# Altium project BAS_DevKITV3.PrjPcb (part 2 of 2)

## Sheet 201_USB3Hub.SchDoc: USB Control Hub
size A2; Organization: Greenfield Tech Solutions; Address1: Molendreef 33; Address2: Ossendrecht; Address3: 4641CS; Address4: The Netherlands; DocumentNumber: P234; Revision: 3.0; SheetNumber: 3; SheetTotal: 8
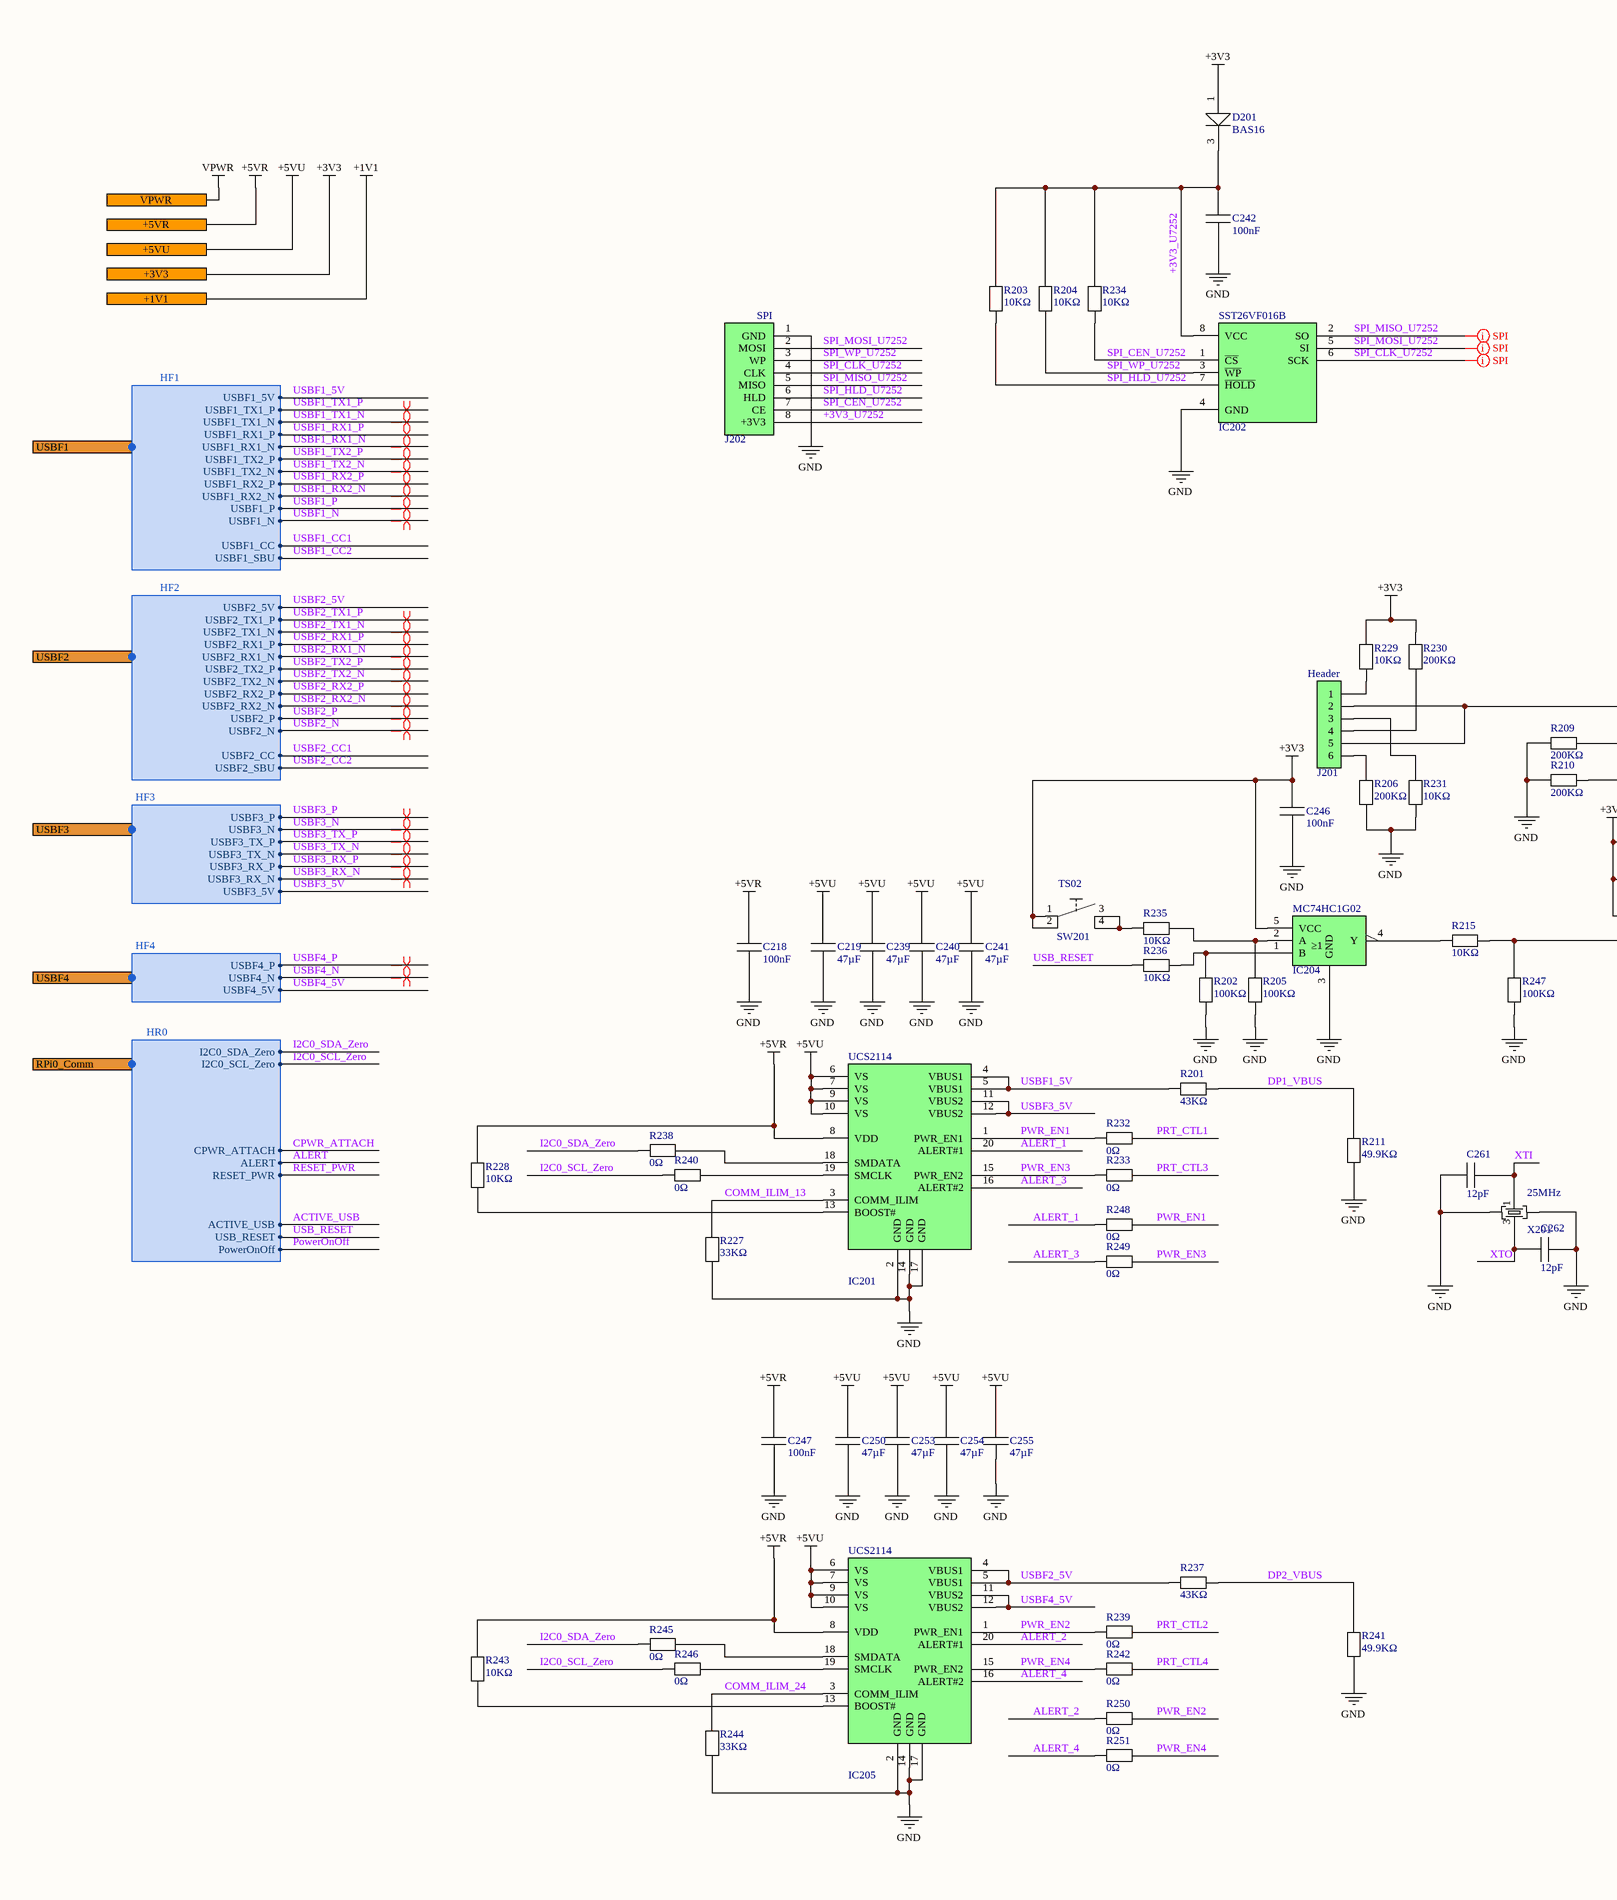
[diagram p8: 201_USB3Hub.SchDoc, left]
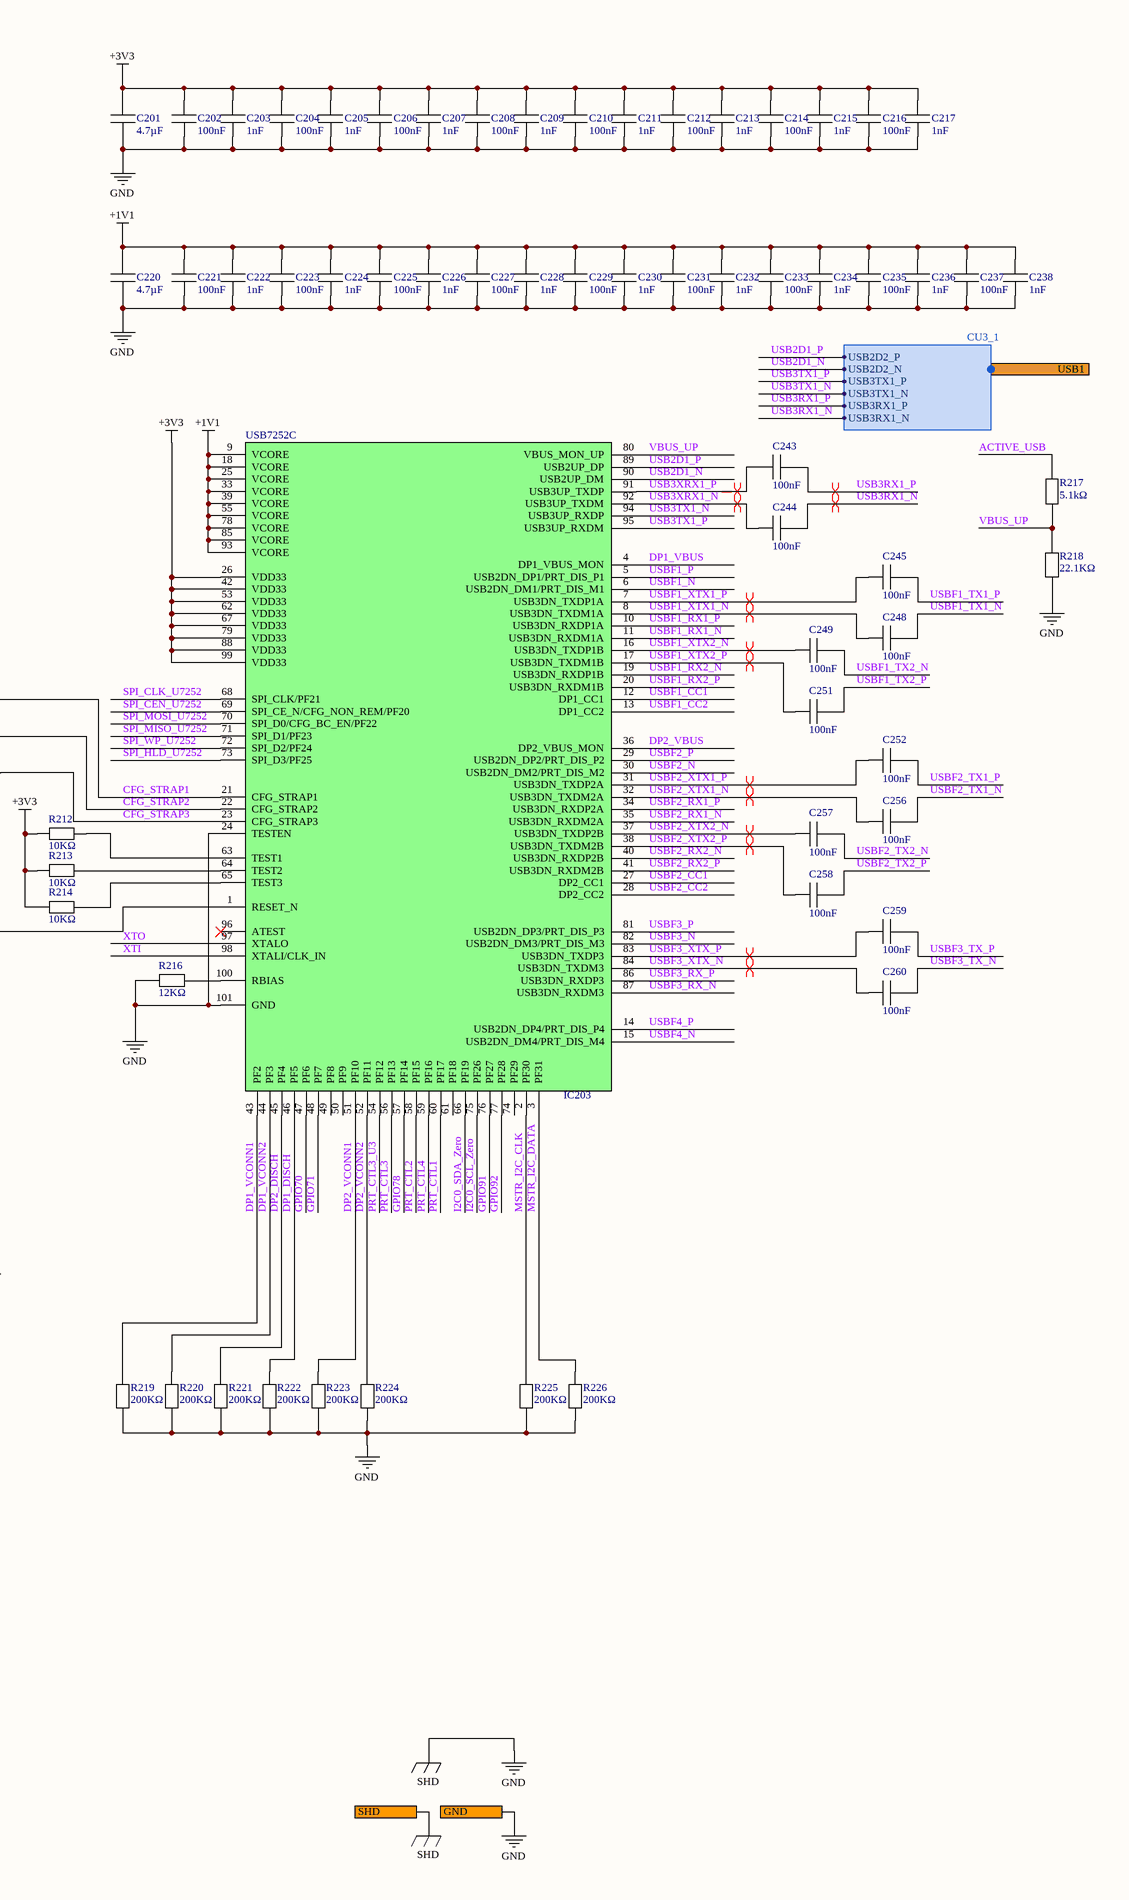
[diagram p9: 201_USB3Hub.SchDoc, right]

### Parts
C201  4.7µF  [C0603]
C202  100nF  [C0402]
C203  1nF  [C0402]
C204  100nF  [C0402]
C205  1nF  [C0402]
C206  100nF  [C0402]
C207  1nF  [C0402]
C208  100nF  [C0402]
C209  1nF  [C0402]
C210  100nF  [C0402]
C211  1nF  [C0402]
C212  100nF  [C0402]
C213  1nF  [C0402]
C214  100nF  [C0402]
C215  1nF  [C0402]
C216  100nF  [C0402]
C217  1nF  [C0402]
C218  100nF  [C0402]
C219  47µF  [C1210]
C220  4.7µF  [C0603]
C221  100nF  [C0402]
C222  1nF  [C0402]
C223  100nF  [C0402]
C224  1nF  [C0402]
C225  100nF  [C0402]
C226  1nF  [C0402]
C227  100nF  [C0402]
C228  1nF  [C0402]
C229  100nF  [C0402]
C230  1nF  [C0402]
C231  100nF  [C0402]
C232  1nF  [C0402]
C233  100nF  [C0402]
C234  1nF  [C0402]
C235  100nF  [C0402]
C236  1nF  [C0402]
C237  100nF  [C0402]
C238  1nF  [C0402]
C239  47µF  [C1210]
C240  47µF  [C1210]
C241  47µF  [C1210]
C242  100nF  [C0402]
C243  100nF  [C0402]
C244  100nF  [C0402]
C245  100nF  [C0402]
C246  100nF  [C0402]
C247  100nF  [C0402]
C248  100nF  [C0402]
C249  100nF  [C0402]
C250  47µF  [C1210]
C251  100nF  [C0402]
C252  100nF  [C0402]
C253  47µF  [C1210]
C254  47µF  [C1210]
C255  47µF  [C1210]
C256  100nF  [C0402]
C257  100nF  [C0402]
C258  100nF  [C0402]
C259  100nF  [C0402]
C260  100nF  [C0402]
C261  12pF  [C0402]
C262  12pF  [C0402]
D201  BAS16  [SOT-23]
IC201  UCS2114  [VQFN-20_3X3]
IC202  SST26VF016B  [SO-8]
IC203  USB7252C  [VQFN-100G_12X12]
IC204  MC74HC1G02  [TSOP-5]
IC205  UCS2114  [VQFN-20_3X3]
J201  Header  [1X6P_2.54MM_SMT]
J202  SPI  [SPI_PROG_TYPE1]
R201  43KΩ  [R0402]
R202  100KΩ  [R0402]
R203  10KΩ  [R0402]
R204  10KΩ  [R0402]
R205  100KΩ  [R0402]
R206  200KΩ  [R0402]
R209  200KΩ  [R0402]
R210  200KΩ  [R0402]
R211  49.9KΩ  [R0402]
R212  10KΩ  [R0402]
R213  10KΩ  [R0402]
R214  10KΩ  [R0402]
R215  10KΩ  [R0402]
R216  12KΩ  [R0402]
R217  5.1kΩ  [R0402]
R218  22.1KΩ  [R0603]
R219  200KΩ  [R0402]
R220  200KΩ  [R0402]
R221  200KΩ  [R0402]
R222  200KΩ  [R0402]
R223  200KΩ  [R0402]
R224  200KΩ  [R0402]
R225  200KΩ  [R0402]
R226  200KΩ  [R0402]
R227  33KΩ  [R0402]
R228  10KΩ  [R0402]
R229  10KΩ  [R0402]
R230  200KΩ  [R0402]
R231  10KΩ  [R0402]
R232  0Ω  [R0402]
R233  0Ω  [R0402]
R234  10KΩ  [R0402]
R235  10KΩ  [R0402]
R236  10KΩ  [R0402]
R237  43KΩ  [R0402]
R238  0Ω  [R0402]
R239  0Ω  [R0402]
R240  0Ω  [R0402]
R241  49.9KΩ  [R0402]
R242  0Ω  [R0402]
R243  10KΩ  [R0402]
R244  33KΩ  [R0402]
R245  0Ω  [R0402]
R246  0Ω  [R0402]
R247  100KΩ  [R0402]
R248  0Ω  [R0402]
R249  0Ω  [R0402]
R250  0Ω  [R0402]
R251  0Ω  [R0402]
SW201  TS02  [TS02]
X201  25MHz  [403W]

### Ports
+1V1, +3V3, +5VR, +5VU, GND, RPi0_Comm (harness HR0), SHD, USB1 (harness CU3_1), USBF1 (harness HF1), USBF2 (harness HF2), USBF3 (harness HF3), USBF4 (harness HF4), VPWR

### Harnesses
HF1: USBF1_5V, USBF1_TX1_P, USBF1_TX1_N, USBF1_RX1_P, USBF1_RX1_N, USBF1_CC, USBF1_SBU, USBF1_RX2_P, USBF1_RX2_N, USBF1_TX2_P, USBF1_TX2_N, USBF1_N, USBF1_P
CU3_1: USB2D2_N, USB2D2_P, USB3TX1_N, USB3TX1_P, USB3RX1_N, USB3RX1_P
HF2: USBF2_5V, USBF2_TX1_P, USBF2_TX1_N, USBF2_RX1_P, USBF2_RX1_N, USBF2_CC, USBF2_SBU, USBF2_RX2_P, USBF2_RX2_N, USBF2_TX2_P, USBF2_TX2_N, USBF2_N, USBF2_P
HF4: USBF4_N, USBF4_P, USBF4_5V
HR0: I2C0_SCL_Zero, I2C0_SDA_Zero, CPWR_ATTACH, PowerOnOff, USB_RESET, ACTIVE_USB, ALERT, RESET_PWR
HF3: USBF3_N, USBF3_P, USBF3_TX_N, USBF3_TX_P, USBF3_RX_N, USBF3_RX_P, USBF3_5V

### Nets
+1V1: C220.1 C221.1 C222.1 C223.1 C224.1 C225.1 C226.1 C227.1 C228.1 C229.1 C230.1 C231.1 C232.1 C233.1 C234.1 C235.1 C236.1 C237.1 C238.1 IC203.9(VCORE) IC203.18(VCORE) IC203.25(VCORE) IC203.33(VCORE) IC203.39(VCORE) IC203.55(VCORE) IC203.78(VCORE) IC203.85(VCORE) IC203.93(VCORE) ; port +1V1
+3V3: C201.1 C202.1 C203.1 C204.1 C205.1 C206.1 C207.1 C208.1 C209.1 C210.1 C211.1 C212.1 C213.1 C214.1 C215.1 C216.1 C217.1 C246.1 D201.1(A) IC203.26(VDD33) IC203.42(VDD33) IC203.53(VDD33) IC203.62(VDD33) IC203.67(VDD33) IC203.79(VDD33) IC203.88(VDD33) IC203.99(VDD33) IC204.5(VCC) R212.1 R213.1 R214.1 R229.2 R230.1 SW201.1 SW201.2 ; port +3V3
+5VR: C218.1 C247.1 IC201.8(VDD) IC205.8(VDD) R228.2 R243.2 ; port +5VR
+5VU: C219.1 C239.1 C240.1 C241.1 C250.1 C253.1 C254.1 C255.1 IC201.6(VS) IC201.7(VS) IC201.9(VS) IC201.10(VS) IC205.6(VS) IC205.7(VS) IC205.9(VS) IC205.10(VS) ; port +5VU
GND: C201.2 C202.2 C203.2 C204.2 C205.2 C206.2 C207.2 C208.2 C209.2 C210.2 C211.2 C212.2 C213.2 C214.2 C215.2 C216.2 C217.2 C218.2 C219.2 C220.2 C221.2 C222.2 C223.2 C224.2 C225.2 C226.2 C227.2 C228.2 C229.2 C230.2 C231.2 C232.2 C233.2 C234.2 C235.2 C236.2 C237.2 C238.2 C239.2 C240.2 C241.2 C242.2 C246.2 C247.2 C250.2 C253.2 C254.2 C255.2 C261.1 C262.2 IC201.2(GND) IC201.14(GND) IC201.17(GND) IC202.4(GND) IC203.24(TESTEN) IC203.101(GND) IC204.3(GND) IC205.2(GND) IC205.14(GND) IC205.17(GND) J202.1(GND) R202.1 R205.1 R206.2 R209.1 R210.1 R211.1 R216.1 R218.1 R219.1 R220.1 R221.1 R222.1 R223.1 R224.1 R225.1 R226.1 R227.1 R231.1 R241.1 R244.1 R247.1 X201.2 X201.4 ; port GND, port SHD  [also labelled SHD]
+3V3_U7252: C242.1 D201.3(K) IC202.8(VCC) J202.8(+3V3) R203.2 R204.2 R234.2
ACTIVE_USB: R217.2 ; port RPi0_Comm.ACTIVE_USB
ALERT_1: IC201.20(ALERT#1) R248.1
ALERT_2: IC205.20(ALERT#1) R250.1
ALERT_3: IC201.16(ALERT#2) R249.1
ALERT_4: IC205.16(ALERT#2) R251.1
CFG_STRAP1: IC203.21(CFG_STRAP1) J201.2 J201.5
CFG_STRAP2: IC203.22(CFG_STRAP2) R209.2
CFG_STRAP3: IC203.23(CFG_STRAP3) R210.2
COMM_ILIM_13: IC201.3(COMM_ILIM) R227.2
COMM_ILIM_24: IC205.3(COMM_ILIM) R244.2
DP1_DISCH: IC203.46(PF5) R222.2
DP1_VBUS: IC203.4(DP1_VBUS_MON) R201.2 R211.2
DP1_VCONN1: IC203.43(PF2) R219.2
DP1_VCONN2: IC203.44(PF3) R220.2
DP2_DISCH: IC203.45(PF4) R221.2
DP2_VBUS: IC203.36(DP2_VBUS_MON) R237.2 R241.2
DP2_VCONN1: IC203.51(PF10) R223.2
DP2_VCONN2: IC203.52(PF11) R224.2
GPIO70: IC203.47(PF6)
GPIO71: IC203.48(PF7)
GPIO78: IC203.57(PF14)
GPIO91: IC203.76(PF27)
GPIO92: IC203.77(PF28)
I2C0_SCL_Zero: IC203.75(PF26) R240.1 R246.1 ; port RPi0_Comm.I2C0_SCL_Zero
I2C0_SDA_Zero: IC203.66(PF19) R238.1 R245.1 ; port RPi0_Comm.I2C0_SDA_Zero
MSTR_I2C_CLK: IC203.2(PF30) R225.2
MSTR_I2C_DATA: IC203.3(PF31) R226.2
PowerOnOff: port RPi0_Comm.PowerOnOff
PRT_CTL1: IC203.60(PF17) R232.2
PRT_CTL2: IC203.58(PF15) R239.2
PRT_CTL3: IC203.56(PF13) R233.2
PRT_CTL3_U3: IC203.54(PF12)
PRT_CTL4: IC203.59(PF16) R242.2
PWR_EN1: IC201.1(PWR_EN1) R232.1 R248.2
PWR_EN2: IC205.1(PWR_EN1) R239.1 R250.2
PWR_EN3: IC201.15(PWR_EN2) R233.1 R249.2
PWR_EN4: IC205.15(PWR_EN2) R242.1 R251.2
SPI_CEN_U7252: IC202.1(~{CS}) IC203.69(SPI_CE_N/CFG_NON_REM/PF20) J202.7(CE) R234.1
SPI_CLK_U7252: IC202.6(SCK) IC203.68(SPI_CLK/PF21) J202.4(CLK)
SPI_HLD_U7252: IC202.7(~{HOLD}) IC203.73(SPI_D3/PF25) J202.6(HLD) R203.1
SPI_MISO_U7252: IC202.2(SO) IC203.71(SPI_D1/PF23) J202.5(MISO)
SPI_MOSI_U7252: IC202.5(SI) IC203.70(SPI_D0/CFG_BC_EN/PF22) J202.2(MOSI)
SPI_WP_U7252: IC202.3(~{WP}) IC203.72(SPI_D2/PF24) J202.3(WP) R204.1
USB2D1_N: IC203.90(USB2UP_DM) ; port USB1.USB2D2_N
USB2D1_P: IC203.89(USB2UP_DP) ; port USB1.USB2D2_P
USB3RX1_N: C244.2 ; port USB1.USB3RX1_N
USB3RX1_P: C243.2 ; port USB1.USB3RX1_P
USB3TX1_N: IC203.94(USB3UP_RXDP) ; port USB1.USB3TX1_N
USB3TX1_P: IC203.95(USB3UP_RXDM) ; port USB1.USB3TX1_P
USB3XRX1_N: C244.1 IC203.92(USB3UP_TXDM)
USB3XRX1_P: C243.1 IC203.91(USB3UP_TXDP)
USB_RESET: R236.2 ; port RPi0_Comm.USB_RESET
USBF1_5V: IC201.4(VBUS1) IC201.5(VBUS1) R201.1 ; port USBF1.USBF1_5V
USBF1_CC1: IC203.12(DP1_CC1) ; port USBF1.USBF1_CC
USBF1_CC2: IC203.13(DP1_CC2) ; port USBF1.USBF1_SBU
USBF1_N: IC203.6(USB2DN_DM1/PRT_DIS_M1) ; port USBF1.USBF1_N
USBF1_P: IC203.5(USB2DN_DP1/PRT_DIS_P1) ; port USBF1.USBF1_P
USBF1_RX1_N: IC203.11(USB3DN_RXDM1A) ; port USBF1.USBF1_RX1_N
USBF1_RX1_P: IC203.10(USB3DN_RXDP1A) ; port USBF1.USBF1_RX1_P
USBF1_RX2_N: IC203.19(USB3DN_RXDP1B) ; port USBF1.USBF1_RX2_N
USBF1_RX2_P: IC203.20(USB3DN_RXDM1B) ; port USBF1.USBF1_RX2_P
USBF1_TX1_N: C248.2 ; port USBF1.USBF1_TX1_N
USBF1_TX1_P: C245.2 ; port USBF1.USBF1_TX1_P
USBF1_TX2_N: C249.2 ; port USBF1.USBF1_TX2_N
USBF1_TX2_P: C251.2 ; port USBF1.USBF1_TX2_P
USBF1_XTX1_N: C248.1 IC203.8(USB3DN_TXDM1A)
USBF1_XTX1_P: C245.1 IC203.7(USB3DN_TXDP1A)
USBF1_XTX2_N: C249.1 IC203.16(USB3DN_TXDP1B)
USBF1_XTX2_P: C251.1 IC203.17(USB3DN_TXDM1B)
USBF2_5V: IC205.4(VBUS1) IC205.5(VBUS1) R237.1 ; port USBF2.USBF2_5V
USBF2_CC1: IC203.27(DP2_CC1) ; port USBF2.USBF2_CC
USBF2_CC2: IC203.28(DP2_CC2) ; port USBF2.USBF2_SBU
USBF2_N: IC203.30(USB2DN_DM2/PRT_DIS_M2) ; port USBF2.USBF2_N
USBF2_P: IC203.29(USB2DN_DP2/PRT_DIS_P2) ; port USBF2.USBF2_P
USBF2_RX1_N: IC203.35(USB3DN_RXDM2A) ; port USBF2.USBF2_RX1_N
USBF2_RX1_P: IC203.34(USB3DN_RXDP2A) ; port USBF2.USBF2_RX1_P
USBF2_RX2_N: IC203.40(USB3DN_RXDP2B) ; port USBF2.USBF2_RX2_N
USBF2_RX2_P: IC203.41(USB3DN_RXDM2B) ; port USBF2.USBF2_RX2_P
USBF2_TX1_N: C256.2 ; port USBF2.USBF2_TX1_N
USBF2_TX1_P: C252.2 ; port USBF2.USBF2_TX1_P
USBF2_TX2_N: C257.2 ; port USBF2.USBF2_TX2_N
USBF2_TX2_P: C258.2 ; port USBF2.USBF2_TX2_P
USBF2_XTX1_N: C256.1 IC203.32(USB3DN_TXDM2A)
USBF2_XTX1_P: C252.1 IC203.31(USB3DN_TXDP2A)
USBF2_XTX2_N: C257.1 IC203.37(USB3DN_TXDP2B)
USBF2_XTX2_P: C258.1 IC203.38(USB3DN_TXDM2B)
USBF3_5V: IC201.11(VBUS2) IC201.12(VBUS2) ; port USBF3.USBF3_5V
USBF3_N: IC203.82(USB2DN_DM3/PRT_DIS_M3) ; port USBF3.USBF3_N
USBF3_P: IC203.81(USB2DN_DP3/PRT_DIS_P3) ; port USBF3.USBF3_P
USBF3_RX_N: IC203.87(USB3DN_RXDM3) ; port USBF3.USBF3_RX_N
USBF3_RX_P: IC203.86(USB3DN_RXDP3) ; port USBF3.USBF3_RX_P
USBF3_TX_N: C260.2 ; port USBF3.USBF3_TX_N
USBF3_TX_P: C259.2 ; port USBF3.USBF3_TX_P
USBF3_XTX_N: C260.1 IC203.84(USB3DN_TXDM3)
USBF3_XTX_P: C259.1 IC203.83(USB3DN_TXDP3)
USBF4_5V: IC205.11(VBUS2) IC205.12(VBUS2) ; port USBF4.USBF4_5V
USBF4_N: IC203.15(USB2DN_DM4/PRT_DIS_M4) ; port USBF4.USBF4_N
USBF4_P: IC203.14(USB2DN_DP4/PRT_DIS_P4) ; port USBF4.USBF4_P
VBUS_UP: IC203.80(VBUS_MON_UP) R217.1 R218.2
XTI: C261.2 IC203.98(XTALI/CLK_IN) X201.1
XTO: C262.1 IC203.97(XTALO) X201.3
NetIC201_13: IC201.13(BOOST#) R228.1
NetIC201_18: IC201.18(SMDATA) R238.2
NetIC201_19: IC201.19(SMCLK) R240.2
NetIC203_1: IC203.1(RESET_N) R215.2 R247.2
NetIC203_63: IC203.63(TEST1) R212.2
NetIC203_64: IC203.64(TEST2) R213.2
NetIC203_65: IC203.65(TEST3) R214.2
NetIC203_100: IC203.100(RBIAS) R216.2
NetIC204_1: IC204.1(B) R202.2 R236.1
NetIC204_2: IC204.2(A) R205.2 R235.1
NetIC204_4: IC204.4(Y) R215.1
NetIC205_13: IC205.13(BOOST#) R243.1
NetIC205_18: IC205.18(SMDATA) R245.2
NetIC205_19: IC205.19(SMCLK) R246.2
NetJ201_1: J201.1 R229.1
NetJ201_3: J201.3 R231.2
NetJ201_4: J201.4 R230.2
NetJ201_6: J201.6 R206.1
NetR235_2: R235.2 SW201.3 SW201.4

Not connected (* = marked no-connect by the designer): IC203 49(PF8) 50(PF9) 61(PF18) 74(PF29) 96(ATEST)*

### Layout directives
differential pair; differential pair class USB3: USB3RX1_N, USB3RX1_P, USB3XRX1_N, USB3XRX1_P, USBF1_N, USBF1_P, USBF1_RX1_N, USBF1_RX1_P, USBF1_RX2_N, USBF1_RX2_P, USBF1_TX1_N, USBF1_TX1_P, USBF1_TX2_N, USBF1_TX2_P, USBF1_XTX1_N, USBF1_XTX1_P, USBF1_XTX2_N, USBF1_XTX2_P, USBF2_N, USBF2_P, USBF2_RX1_N, USBF2_RX1_P, USBF2_RX2_N, USBF2_RX2_P, USBF2_TX1_N, USBF2_TX1_P, USBF2_TX2_N, USBF2_TX2_P, USBF2_XTX1_N, USBF2_XTX1_P, USBF2_XTX2_N, USBF2_XTX2_P, USBF3_N, USBF3_P, USBF3_RX_N, USBF3_RX_P, USBF3_TX_N, USBF3_TX_P, USBF3_XTX_N, USBF3_XTX_P, USBF4_N, USBF4_P
net class SPI_USB7252C: SPI_CLK_U7252, SPI_MISO_U7252, SPI_MOSI_U7252

### Notes on the sheet
- Title
- Size:
- Date:
- File:
- A2
- Number:
- Time:
- Revision:
- Sheet
- of
- (in symbol IC0061) ≥1

### Library data of the parts
C201 C220 = CA0002: 4.7µF 16V 10% X5R; Part Number: CA0002; ManfactPart: C1608X5R1C475K080AC; ID: 2; RefVal: 4.7µF
C202 C204 C206 C208 C210 C212 C214 C216 C218 C221 C223 C225 C227 C229 C231 C233 C235 C237 C242-C249 C251 C252 C256-C260 = CA0010: 100nF 16V 10% X7R; Part Number: CA0010; ManfactPart: GCM155R71C104KA55D; ID: 10; RefVal: 100nF
C203 C205 C207 C209 C211 C213 C215 C217 C222 C224 C226 C228 C230 C232 C234 C236 C238 = CA0031: 1nF 50V 1% C0G; Part Number: CA0031; ManfactPart: GRT1555C1H102FA02D; ID: 31; RefVal: 1nF
C219 C239-C241 C250 C253-C255 = CA0007: 47µF 16V 20% X5R; Part Number: CA0007; ManfactPart: EMK325ABJ476MM8P; ID: 7; RefVal: 47µF
C261 C262 = CA0059: 12pF 16V 1% C0G; Part Number: CA0059; ManfactPart: VJ0402A120FXJCW1BC; ID: 59; RefVal: 12pF
D201 = DI0010: Diodes - General Purpose, Power, Switching 100Vll Signal Switching Diodes 2A; Part Number: DI0010; ManfactPart: BAS16_R1_00001; ID: 10; RefVal: BAS16
IC201 IC205 = IC0056: Dual USB Power Switch with Integrated Current Sensor; Part Number: IC0056; ID: 56; RefVal: UCS2114; ManfactPart: UCS2114
IC202 = IC0059: 16 Mbit Serial Quad I/O (SQI) Flash Memory; Part Number: IC0059; ManfactPart: SST26VF016B-104V/SN; ID: 59; RefVal: SST26VF016B
IC203 = IC0047: 4-Port USB 3.2 Gen 2 Type-C Controller Hub; Part Number: IC0047; ID: 47; RefVal: USB7252C; ManfactPart: USB7252C
IC204 = IC0061: Logic Gates 2-6V Single 2-Input NOR; Part Number: IC0061; ManfactPart: MC74HC1G02DTT1G; ID: 61; RefVal: MC74HC1G02
J201 = CO0043: Header 1x6P SMT Mount; Part Number: CO0043; ManfactPart: G800MJ302018EU; ID: 43; RefVal: Header
J202 = ME0028: SPI Programming connection; Part Number: ME0028; ID: 28; RefVal: SPI
R201 R237 = RS0076: 43KΩ 1% 62.5mW 100PPM; Part Number: RS0076; ManfactPart: CRCW040243K0FKEDC; ID: 76; RefVal: 43KΩ
R202 R205 R247 = RS0036: 100KΩ 1% 62.5mW 100PPM; Part Number: RS0036; ManfactPart: AC0402FR-13100KL; ID: 36; RefVal: 100KΩ
R203 R204 R212-R215 R228 R229 R231 R234-R236 R243 = RS0011: 10KΩ 1% 62.5mW; Part Number: RS0011; ManfactPart: WR04X1002FTL; ID: 11; RefVal: 10KΩ
R206 R209 R210 R219-R226 R230 = RS0045: 200KΩ 1% 62.5mW 100PPM; Part Number: RS0045; ManfactPart: CRG0402F200K; ID: 45; RefVal: 200KΩ
R211 R241 = RS0077: 49.9KΩ 1% 62.5mW 100PPM; Part Number: RS0077; ManfactPart: 0402WGF4992TCE; ID: 77; RefVal: 49.9KΩ
R216 = RS0015: 12KΩ 1% 62.5mW; Part Number: RS0015; ManfactPart: RC0402FR-1312KL; ID: 15; RefVal: 12KΩ
R217 = RS0038: 5.1KΩ 1% 62.5mW 100PPM; Part Number: RS0038; ManfactPart: CRCW04025K10FKEDC; ID: 38; RefVal: 5.1kΩ
R218 = RS0040: 22.1KΩ 1% 100mW 100PPM; Part Number: RS0040; ManfactPart: RC0603FR-0722K1L; ID: 40; RefVal: 22.1KΩ
R227 R244 = RS0075: 33KΩ 1% 62.5mW 100PPM; Part Number: RS0075; ManfactPart: 0402WGF3302TCE; ID: 75; RefVal: 33KΩ
R232 R233 R238-R240 R242 R245 R246 R248-R251 = RS0074: 0Ω 62.5mW; Part Number: RS0074; ManfactPart: 0402WGJ0000TCE; ID: 74; RefVal: 0Ω
SW201 = SW0005: TACTILE SWITCH SPST; Part Number: SW0005; ManfactPart: TS02-66-50-BK-160-SCR-D; ID: 5; RefVal: TS02
X201 = CR0003: 25MHz 8pF 20PPM; Part Number: CR0003; ManfactPart: 403WF25012IK; ID: 3; RefVal: 25MHz

## Sheet 601_PCIe-USB.SchDoc: PCIE to USB Hub
size A2; Organization: Greenfield Tech Solutions; Address1: Molendreef 33; Address2: Ossendrecht; Address3: 4641CS; Address4: The Netherlands; DocumentNumber: P234; Revision: 3.0; SheetNumber: 7; SheetTotal: 8
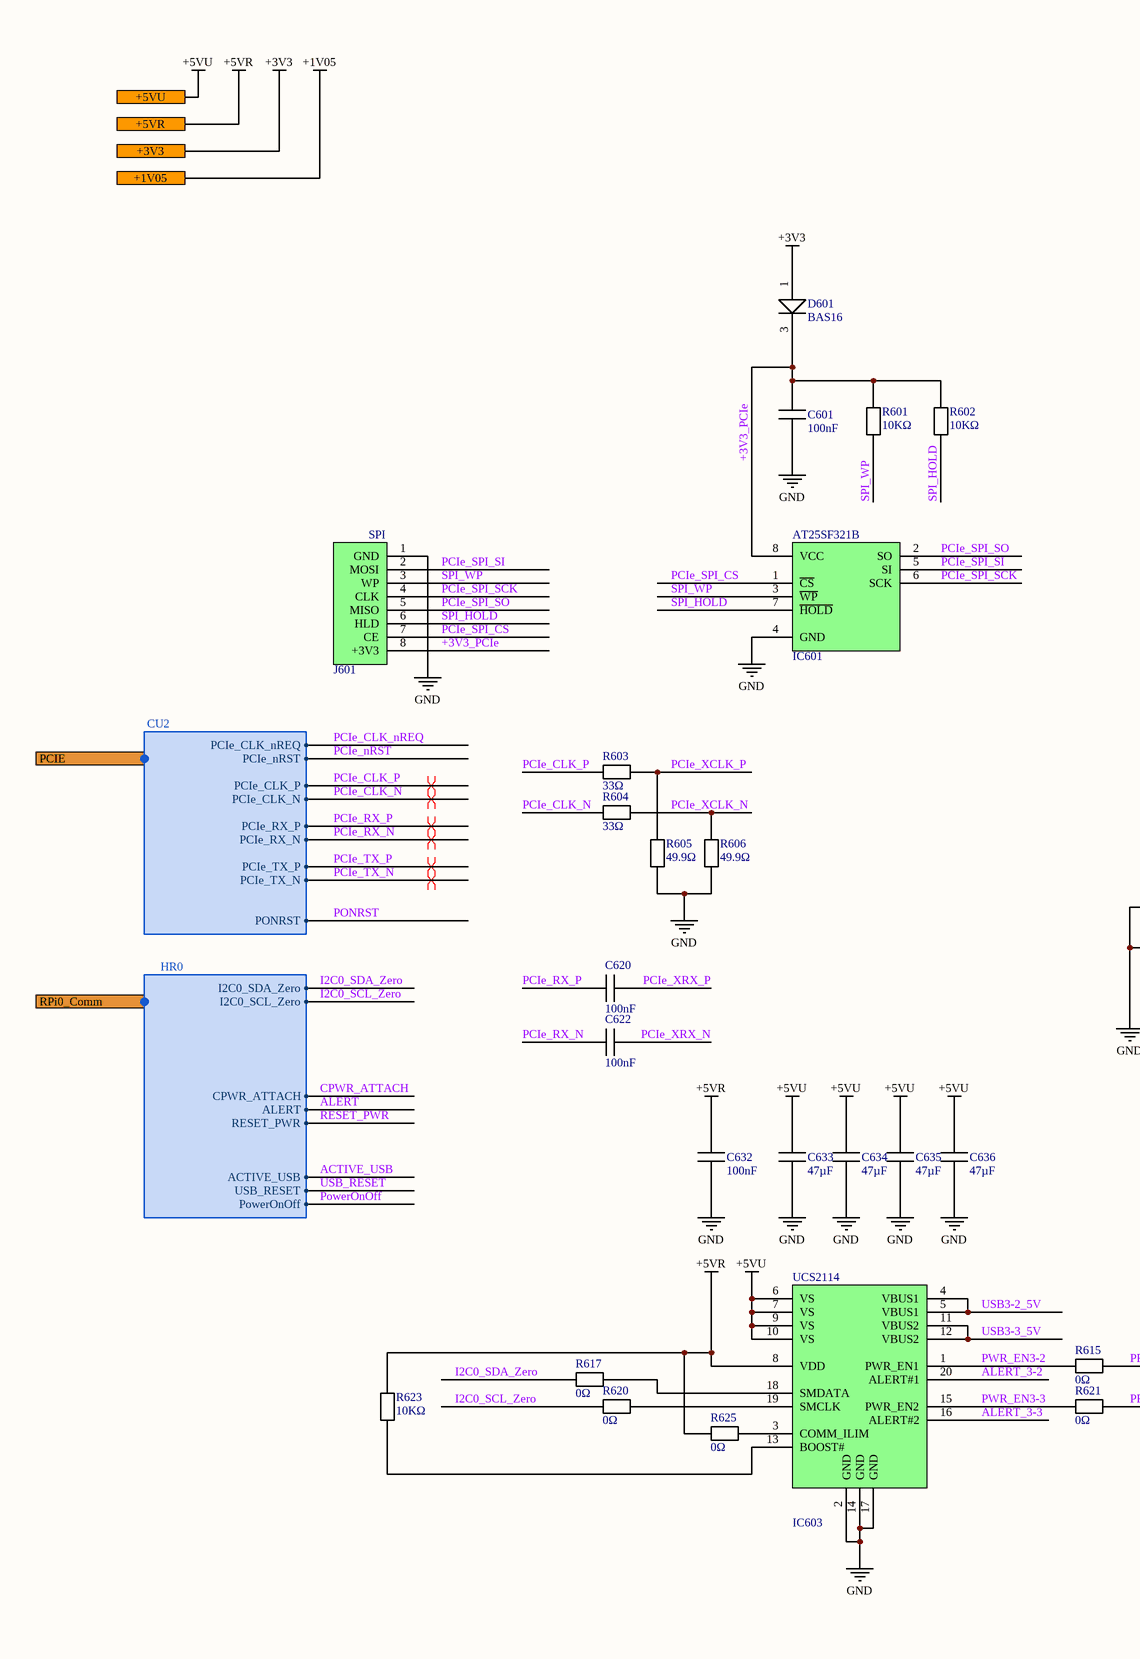
[diagram p10: 601_PCIe-USB.SchDoc, left]
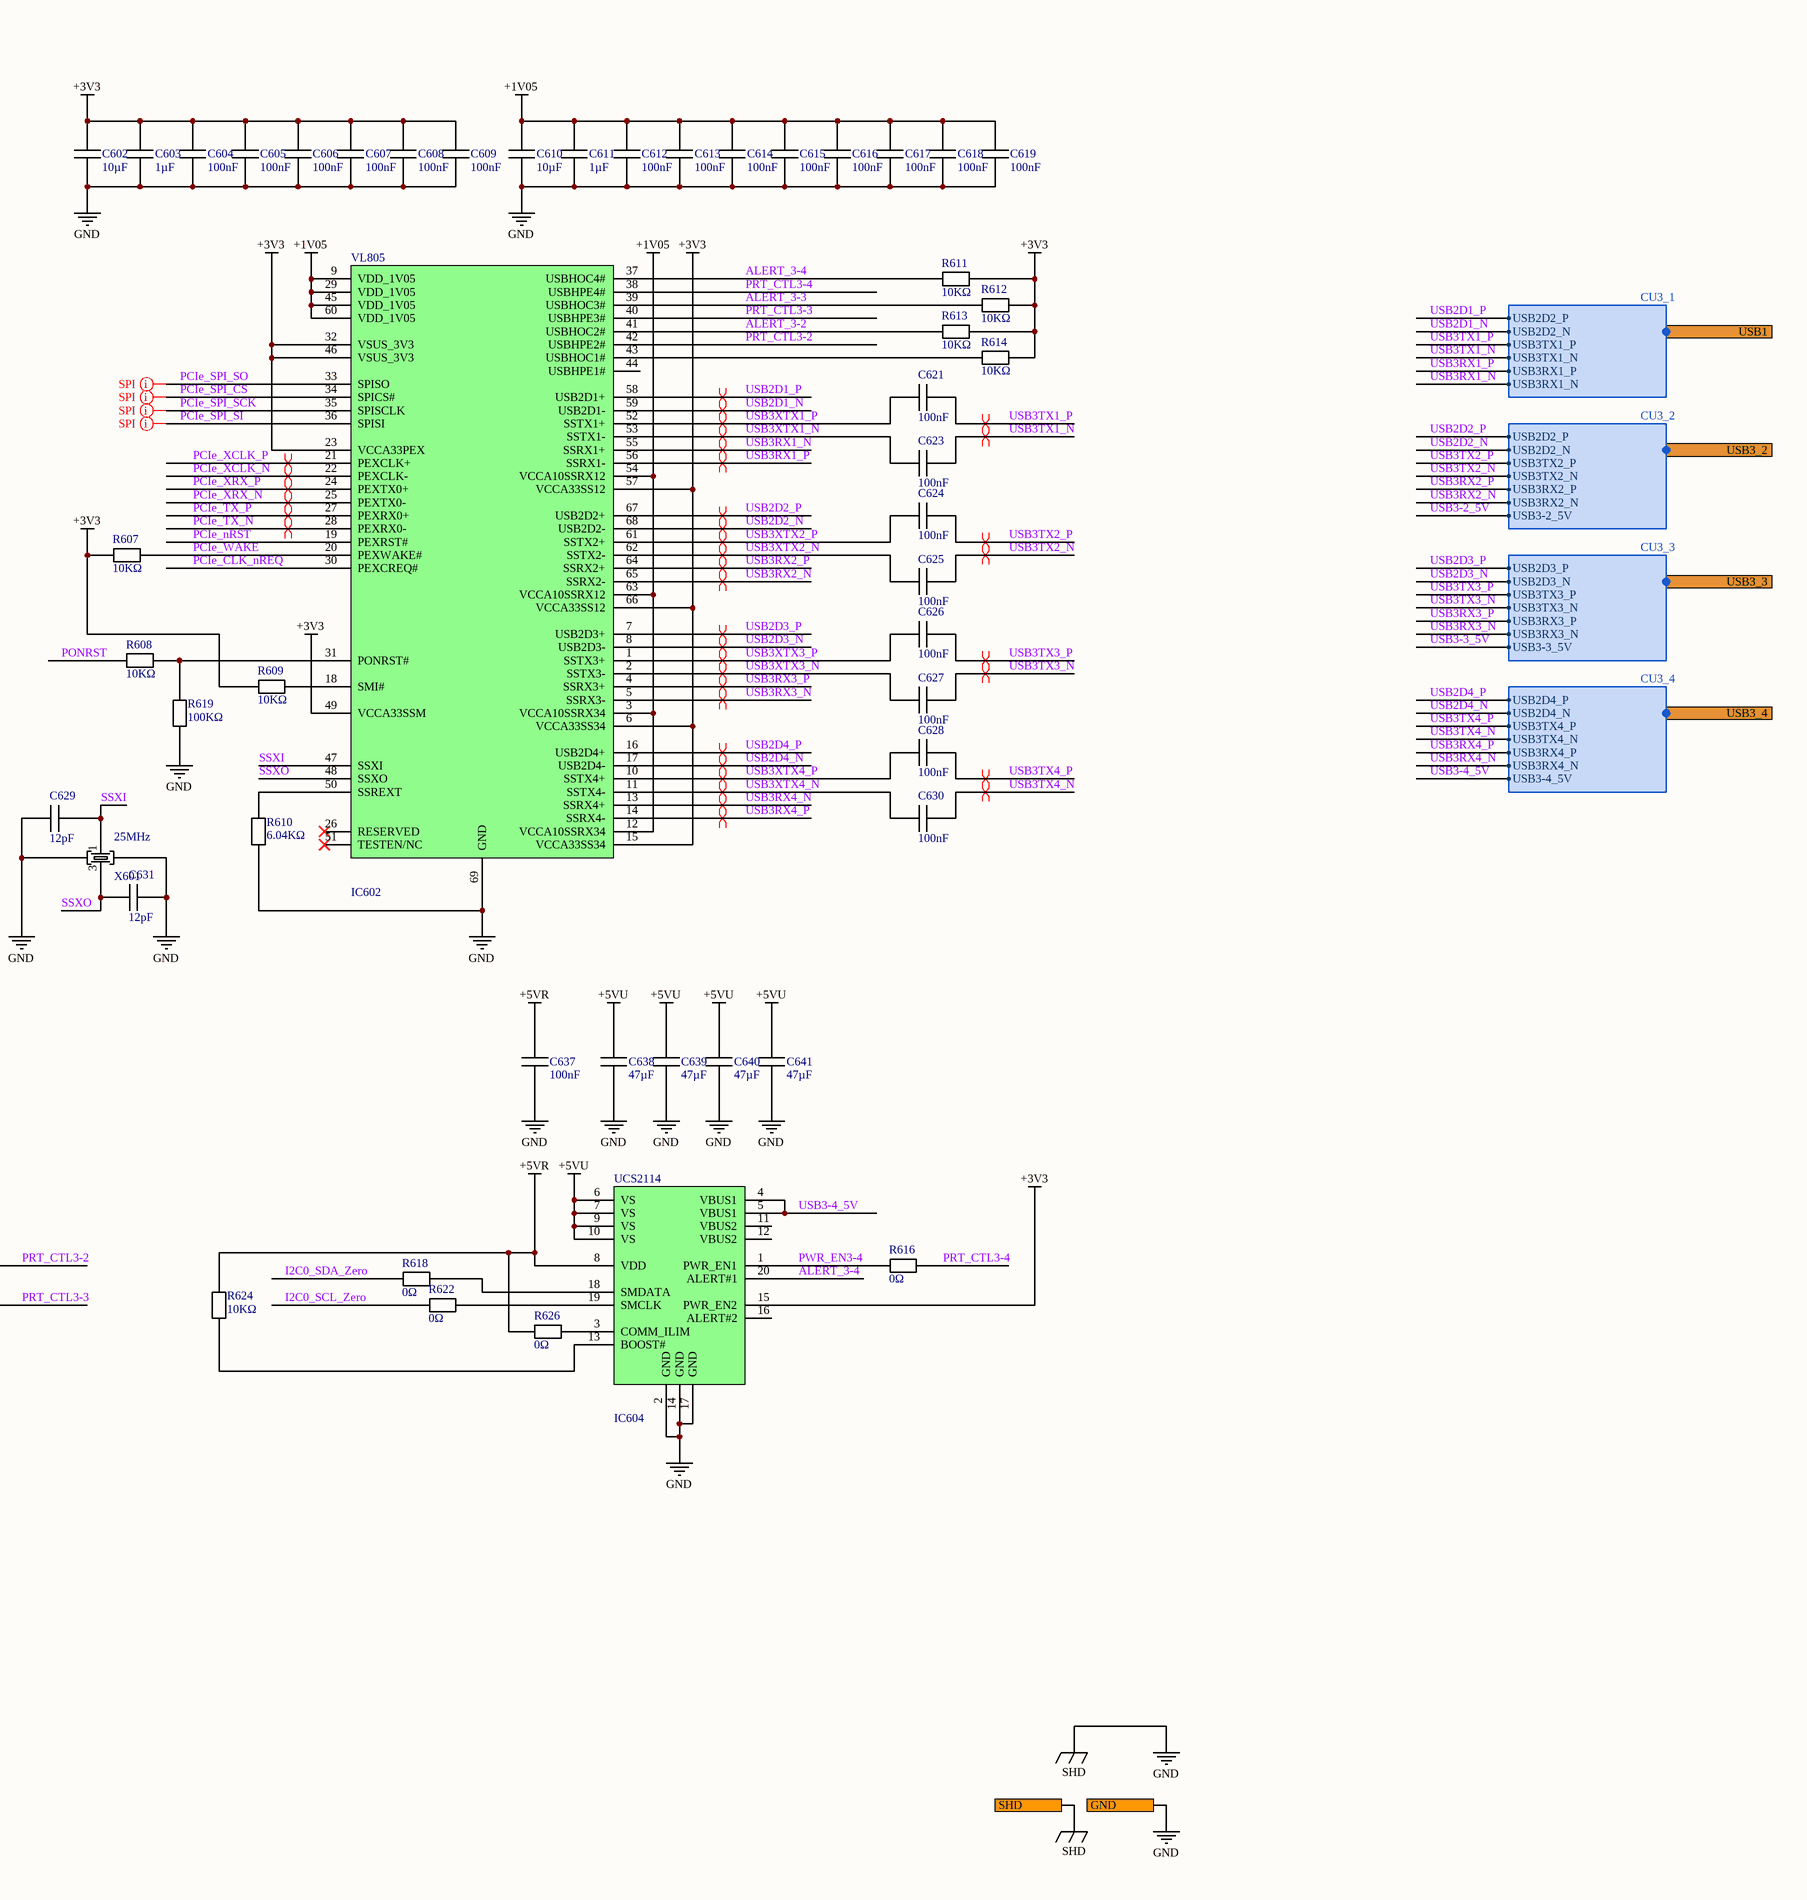
[diagram p11: 601_PCIe-USB.SchDoc, right]

### Parts
C601  100nF  [C0402]
C602  10µF  [C0603]
C603  1µF  [C0603]
C604  100nF  [C0402]
C605  100nF  [C0402]
C606  100nF  [C0402]
C607  100nF  [C0402]
C608  100nF  [C0402]
C609  100nF  [C0402]
C610  10µF  [C0603]
C611  1µF  [C0603]
C612  100nF  [C0402]
C613  100nF  [C0402]
C614  100nF  [C0402]
C615  100nF  [C0402]
C616  100nF  [C0402]
C617  100nF  [C0402]
C618  100nF  [C0402]
C619  100nF  [C0402]
C620  100nF  [C0402]
C621  100nF  [C0402]
C622  100nF  [C0402]
C623  100nF  [C0402]
C624  100nF  [C0402]
C625  100nF  [C0402]
C626  100nF  [C0402]
C627  100nF  [C0402]
C628  100nF  [C0402]
C629  12pF  [C0402]
C630  100nF  [C0402]
C631  12pF  [C0402]
C632  100nF  [C0402]
C633  47µF  [C1210]
C634  47µF  [C1210]
C635  47µF  [C1210]
C636  47µF  [C1210]
C637  100nF  [C0402]
C638  47µF  [C1210]
C639  47µF  [C1210]
C640  47µF  [C1210]
C641  47µF  [C1210]
D601  BAS16  [SOT-23]
IC601  AT25SF321B  [SO-8]
IC602  VL805  [QFN-68G_8X8]
IC603  UCS2114  [VQFN-20_3X3]
IC604  UCS2114  [VQFN-20_3X3]
J601  SPI  [SPI_PROG_TYPE1]
R601  10KΩ  [R0402]
R602  10KΩ  [R0402]
R603  33Ω  [R0201]
R604  33Ω  [R0201]
R605  49.9Ω  [R0201]
R606  49.9Ω  [R0201]
R607  10KΩ  [R0402]
R608  10KΩ  [R0402]
R609  10KΩ  [R0402]
R610  6.04KΩ  [R0402]
R611  10KΩ  [R0402]
R612  10KΩ  [R0402]
R613  10KΩ  [R0402]
R614  10KΩ  [R0402]
R615  0Ω  [R0402]
R616  0Ω  [R0402]
R617  0Ω  [R0402]
R618  0Ω  [R0402]
R619  100KΩ  [R0402]
R620  0Ω  [R0402]
R621  0Ω  [R0402]
R622  0Ω  [R0402]
R623  10KΩ  [R0402]
R624  10KΩ  [R0402]
R625  0Ω  [R0402]
R626  0Ω  [R0402]
X601  25MHz  [403W]

### Ports
+1V05, +3V3, +5VR, +5VU, GND, PCIE (harness CU2), RPi0_Comm (harness HR0), SHD, USB1 (harness CU3_1), USB3_2 (harness CU3_2), USB3_3 (harness CU3_3), USB3_4 (harness CU3_4)

### Harnesses
CU2: PCIe_nRST, PCIe_CLK_nREQ, PCIe_CLK_N, PCIe_CLK_P, PCIe_RX_N, PCIe_RX_P, PCIe_TX_N, PCIe_TX_P, PONRST
CU3_1: USB2D2_N, USB2D2_P, USB3TX1_N, USB3TX1_P, USB3RX1_N, USB3RX1_P
CU3_2: USB2D2_N, USB2D2_P, USB3TX2_N, USB3TX2_P, USB3RX2_N, USB3RX2_P, USB3-2_5V
CU3_3: USB2D3_N, USB2D3_P, USB3TX3_N, USB3TX3_P, USB3RX3_N, USB3RX3_P, USB3-3_5V
CU3_4: USB2D4_N, USB2D4_P, USB3TX4_N, USB3TX4_P, USB3RX4_N, USB3RX4_P, USB3-4_5V
HR0: I2C0_SCL_Zero, I2C0_SDA_Zero, CPWR_ATTACH, PowerOnOff, USB_RESET, ACTIVE_USB, ALERT, RESET_PWR

### Nets
+1V05: C610.1 C611.1 C612.1 C613.1 C614.1 C615.1 C616.1 C617.1 C618.1 C619.1 IC602.3(VCCA10SSRX34) IC602.9(VDD_1V05) IC602.12(VCCA10SSRX34) IC602.29(VDD_1V05) IC602.45(VDD_1V05) IC602.54(VCCA10SSRX12) IC602.60(VDD_1V05) IC602.63(VCCA10SSRX12) ; port +1V05
+3V3: C602.1 C603.1 C604.1 C605.1 C606.1 C607.1 C608.1 C609.1 D601.1(A) IC602.6(VCCA33SS34) IC602.15(VCCA33SS34) IC602.23(VCCA33PEX) IC602.32(VSUS_3V3) IC602.46(VSUS_3V3) IC602.49(VCCA33SSM) IC602.57(VCCA33SS12) IC602.66(VCCA33SS12) IC604.15(PWR_EN2) R607.2 R609.1 R611.1 R612.1 R613.1 R614.1 ; port +3V3
+5VR: C632.1 C637.1 IC603.8(VDD) IC604.8(VDD) R623.2 R624.2 R625.1 R626.1 ; port +5VR
+5VU: C633.1 C634.1 C635.1 C636.1 C638.1 C639.1 C640.1 C641.1 IC603.6(VS) IC603.7(VS) IC603.9(VS) IC603.10(VS) IC604.6(VS) IC604.7(VS) IC604.9(VS) IC604.10(VS) ; port +5VU
GND: C601.2 C602.2 C603.2 C604.2 C605.2 C606.2 C607.2 C608.2 C609.2 C610.2 C611.2 C612.2 C613.2 C614.2 C615.2 C616.2 C617.2 C618.2 C619.2 C629.1 C631.2 C632.2 C633.2 C634.2 C635.2 C636.2 C637.2 C638.2 C639.2 C640.2 C641.2 IC601.4(GND) IC602.69(GND) IC603.2(GND) IC603.14(GND) IC603.17(GND) IC604.2(GND) IC604.14(GND) IC604.17(GND) J601.1(GND) R605.1 R606.1 R610.1 R619.1 X601.2 X601.4 ; port GND, port SHD  [also labelled SHD]
+3V3_PCIe: C601.1 D601.3(K) IC601.8(VCC) J601.8(+3V3) R601.1 R602.1
ALERT_3-2: IC602.41(USBHOC2#) IC603.20(ALERT#1) R613.2
ALERT_3-3: IC602.39(USBHOC3#) IC603.16(ALERT#2) R612.2
ALERT_3-4: IC602.37(USBHOC4#) IC604.20(ALERT#1) R611.2
I2C0_SCL_Zero: R620.1 R622.1 ; port RPi0_Comm.I2C0_SCL_Zero
I2C0_SDA_Zero: R617.1 R618.1 ; port RPi0_Comm.I2C0_SDA_Zero
PCIe_CLK_N: R604.1 ; port PCIE.PCIe_CLK_N
PCIe_CLK_nREQ: IC602.30(PEXCREQ#) ; port PCIE.PCIe_CLK_nREQ
PCIe_CLK_P: R603.1 ; port PCIE.PCIe_CLK_P
PCIe_nRST: IC602.19(PEXRST#) ; port PCIE.PCIe_nRST
PCIe_RX_N: C622.1 ; port PCIE.PCIe_RX_N
PCIe_RX_P: C620.1 ; port PCIE.PCIe_RX_P
PCIe_SPI_CS: IC601.1(~{CS}) IC602.34(SPICS#) J601.7(CE)
PCIe_SPI_SCK: IC601.6(SCK) IC602.35(SPISCLK) J601.4(CLK)
PCIe_SPI_SI: IC601.5(SI) IC602.36(SPISI) J601.2(MOSI)
PCIe_SPI_SO: IC601.2(SO) IC602.33(SPISO) J601.5(MISO)
PCIe_TX_N: IC602.28(PEXRX0-) ; port PCIE.PCIe_TX_N
PCIe_TX_P: IC602.27(PEXRX0+) ; port PCIE.PCIe_TX_P
PCIe_WAKE: IC602.20(PEXWAKE#) R607.1
PCIe_XCLK_N: IC602.22(PEXCLK-) R604.2 R606.2
PCIe_XCLK_P: IC602.21(PEXCLK+) R603.2 R605.2
PCIe_XRX_N: C622.2 IC602.25(PEXTX0-)
PCIe_XRX_P: C620.2 IC602.24(PEXTX0+)
PONRST: R608.2 ; port PCIE.PONRST
PowerOnOff: port RPi0_Comm.PowerOnOff
PRT_CTL3-2: IC602.42(USBHPE2#) R615.2
PRT_CTL3-3: IC602.40(USBHPE3#) R621.2
PRT_CTL3-4: IC602.38(USBHPE4#) R616.2
PWR_EN3-2: IC603.1(PWR_EN1) R615.1
PWR_EN3-3: IC603.15(PWR_EN2) R621.1
PWR_EN3-4: IC604.1(PWR_EN1) R616.1
SPI_HOLD: IC601.7(~{HOLD}) J601.6(HLD) R602.2
SPI_WP: IC601.3(~{WP}) J601.3(WP) R601.2
SSXI: C629.2 IC602.47(SSXI) X601.1
SSXO: C631.1 IC602.48(SSXO) X601.3
USB2D1_N: IC602.59(USB2D1-) ; port USB1.USB2D2_N
USB2D1_P: IC602.58(USB2D1+) ; port USB1.USB2D2_P
USB2D2_N: IC602.68(USB2D2-) ; port USB3_2.USB2D2_N
USB2D2_P: IC602.67(USB2D2+) ; port USB3_2.USB2D2_P
USB2D3_N: IC602.8(USB2D3-) ; port USB3_3.USB2D3_N
USB2D3_P: IC602.7(USB2D3+) ; port USB3_3.USB2D3_P
USB2D4_N: IC602.17(USB2D4-) ; port USB3_4.USB2D4_N
USB2D4_P: IC602.16(USB2D4+) ; port USB3_4.USB2D4_P
USB3-2_5V: IC603.4(VBUS1) IC603.5(VBUS1) ; port USB3_2.USB3-2_5V
USB3-3_5V: IC603.11(VBUS2) IC603.12(VBUS2) ; port USB3_3.USB3-3_5V
USB3-4_5V: IC604.4(VBUS1) IC604.5(VBUS1) ; port USB3_4.USB3-4_5V
USB3RX1_N: IC602.55(SSRX1+) ; port USB1.USB3RX1_N
USB3RX1_P: IC602.56(SSRX1-) ; port USB1.USB3RX1_P
USB3RX2_N: IC602.65(SSRX2-) ; port USB3_2.USB3RX2_N
USB3RX2_P: IC602.64(SSRX2+) ; port USB3_2.USB3RX2_P
USB3RX3_N: IC602.5(SSRX3-) ; port USB3_3.USB3RX3_N
USB3RX3_P: IC602.4(SSRX3+) ; port USB3_3.USB3RX3_P
USB3RX4_N: IC602.13(SSRX4+) ; port USB3_4.USB3RX4_N
USB3RX4_P: IC602.14(SSRX4-) ; port USB3_4.USB3RX4_P
USB3TX1_N: C623.2 ; port USB1.USB3TX1_N
USB3TX1_P: C621.2 ; port USB1.USB3TX1_P
USB3TX2_N: C625.2 ; port USB3_2.USB3TX2_N
USB3TX2_P: C624.2 ; port USB3_2.USB3TX2_P
USB3TX3_N: C627.2 ; port USB3_3.USB3TX3_N
USB3TX3_P: C626.2 ; port USB3_3.USB3TX3_P
USB3TX4_N: C630.2 ; port USB3_4.USB3TX4_N
USB3TX4_P: C628.2 ; port USB3_4.USB3TX4_P
USB3XTX1_N: C623.1 IC602.53(SSTX1-)
USB3XTX1_P: C621.1 IC602.52(SSTX1+)
USB3XTX2_N: C625.1 IC602.62(SSTX2-)
USB3XTX2_P: C624.1 IC602.61(SSTX2+)
USB3XTX3_N: C627.1 IC602.2(SSTX3-)
USB3XTX3_P: C626.1 IC602.1(SSTX3+)
USB3XTX4_N: C630.1 IC602.11(SSTX4-)
USB3XTX4_P: C628.1 IC602.10(SSTX4+)
NetIC602_18: IC602.18(SMI#) R609.2
NetIC602_31: IC602.31(PONRST#) R608.1 R619.2
NetIC602_43: IC602.43(USBHOC1#) R614.2
NetIC602_50: IC602.50(SSREXT) R610.2
NetIC603_3: IC603.3(COMM_ILIM) R625.2
NetIC603_13: IC603.13(BOOST#) R623.1
NetIC603_18: IC603.18(SMDATA) R617.2
NetIC603_19: IC603.19(SMCLK) R620.2
NetIC604_3: IC604.3(COMM_ILIM) R626.2
NetIC604_13: IC604.13(BOOST#) R624.1
NetIC604_18: IC604.18(SMDATA) R618.2
NetIC604_19: IC604.19(SMCLK) R622.2

Not connected (* = marked no-connect by the designer): IC602 26(RESERVED)* 44(USBHPE1#) 51(TESTEN/NC)*; IC604 11(VBUS2) 12(VBUS2) 16(ALERT#2)

### Layout directives
differential pair; differential pair class PCIE: PCIe_CLK_N, PCIe_CLK_P, PCIe_RX_N, PCIe_RX_P, PCIe_TX_N, PCIe_TX_P, PCIe_XCLK_N, PCIe_XCLK_P, PCIe_XRX_N, PCIe_XRX_P
differential pair; differential pair class USB3: USB2D1_N, USB2D1_P, USB2D2_N, USB2D2_P, USB2D3_N, USB2D3_P, USB2D4_N, USB2D4_P, USB3RX1_N, USB3RX1_P, USB3RX2_N, USB3RX2_P, USB3RX3_N, USB3RX3_P, USB3RX4_N, USB3RX4_P, USB3TX1_N, USB3TX1_P, USB3TX2_N, USB3TX2_P, USB3TX3_N, USB3TX3_P, USB3TX4_N, USB3TX4_P, USB3XTX1_N, USB3XTX1_P, USB3XTX2_N, USB3XTX2_P, USB3XTX3_N, USB3XTX3_P, USB3XTX4_N, USB3XTX4_P
net class SPI_VL805: PCIe_SPI_CS, PCIe_SPI_SCK, PCIe_SPI_SI, PCIe_SPI_SO

### Notes on the sheet
- Title
- Size:
- Date:
- File:
- A2
- Number:
- Time:
- Revision:
- Sheet
- of

### Library data of the parts
C601 C604-C609 C612-C628 C630 C632 C637 = CA0010: as C202 on sheet 201_USB3Hub; RefVal: 100nF
C602 C610 = CA0008: 10µF 16V 20% X5R; Part Number: CA0008; ManfactPart: GRM188R61C106MAALD; ID: 8; RefVal: 10µF
C603 C611 = CA0003: 1µF 16V 10% X5R; Part Number: CA0003; ManfactPart: C1608X5R1C105K080AA; ID: 3; RefVal: 1µF
C629 C631 = CA0059: as C261 on sheet 201_USB3Hub; RefVal: 12pF
C633-C636 C638-C641 = CA0007: as C219 on sheet 201_USB3Hub; RefVal: 47µF
D601 = DI0010: as D201 on sheet 201_USB3Hub; RefVal: BAS16
IC601 = IC0053: 32-Mbit SPI Serial Flash Memory with Dual-I/O and Quad-I/O Support; Part Number: IC0053; ManfactPart: AT25SF321B-SSHB-T; ID: 53; RefVal: AT25SF321B
IC602 = IC0046: VL805 4-Port USB 3.0 Host Controller; Part Number: IC0046; ManfactPart: VL805-Q6; ID: 46; RefVal: VL805
IC603 IC604 = IC0056: as IC201 on sheet 201_USB3Hub; RefVal: UCS2114; ManfactPart: UCS2114
J601 = ME0028: as J202 on sheet 201_USB3Hub; RefVal: SPI
R601 R602 R607-R609 R611-R614 R623 R624 = RS0011: as R203 on sheet 201_USB3Hub; RefVal: 10KΩ
R603 R604 = RS0067: 33Ω 5% 50mW 200PPM; Part Number: RS0067; ManfactPart: 0201WMJ0330TEE; ID: 67; RefVal: 33Ω
R605 R606 = RS0069: 49.9Ω 1% 50mW 200PPM; Part Number: RS0069; ManfactPart: 0201WMF499JTEE; ID: 69; RefVal: 49.9Ω
R610 = RS0017: 6.04KΩ 1% 62.5mW; Part Number: RS0017; ManfactPart: RC0402FR-076K04L; ID: 17; RefVal: 6.04KΩ
R615-R618 R620-R622 R625 R626 = RS0074: as R232 on sheet 201_USB3Hub; RefVal: 0Ω
R619 = RS0036: as R202 on sheet 201_USB3Hub; RefVal: 100KΩ
X601 = CR0003: as X201 on sheet 201_USB3Hub; RefVal: 25MHz

## Sheet 701_PCIe-USBports.SchDoc: USB MainHub Ports
size A2; Organization: Greenfield Tech Solutions; Address1: Molendreef 33; Address2: Ossendrecht; Address3: 4641CS; Address4: The Netherlands; DocumentNumber: P234; Revision: 3.0; SheetNumber: 8; SheetTotal: 8
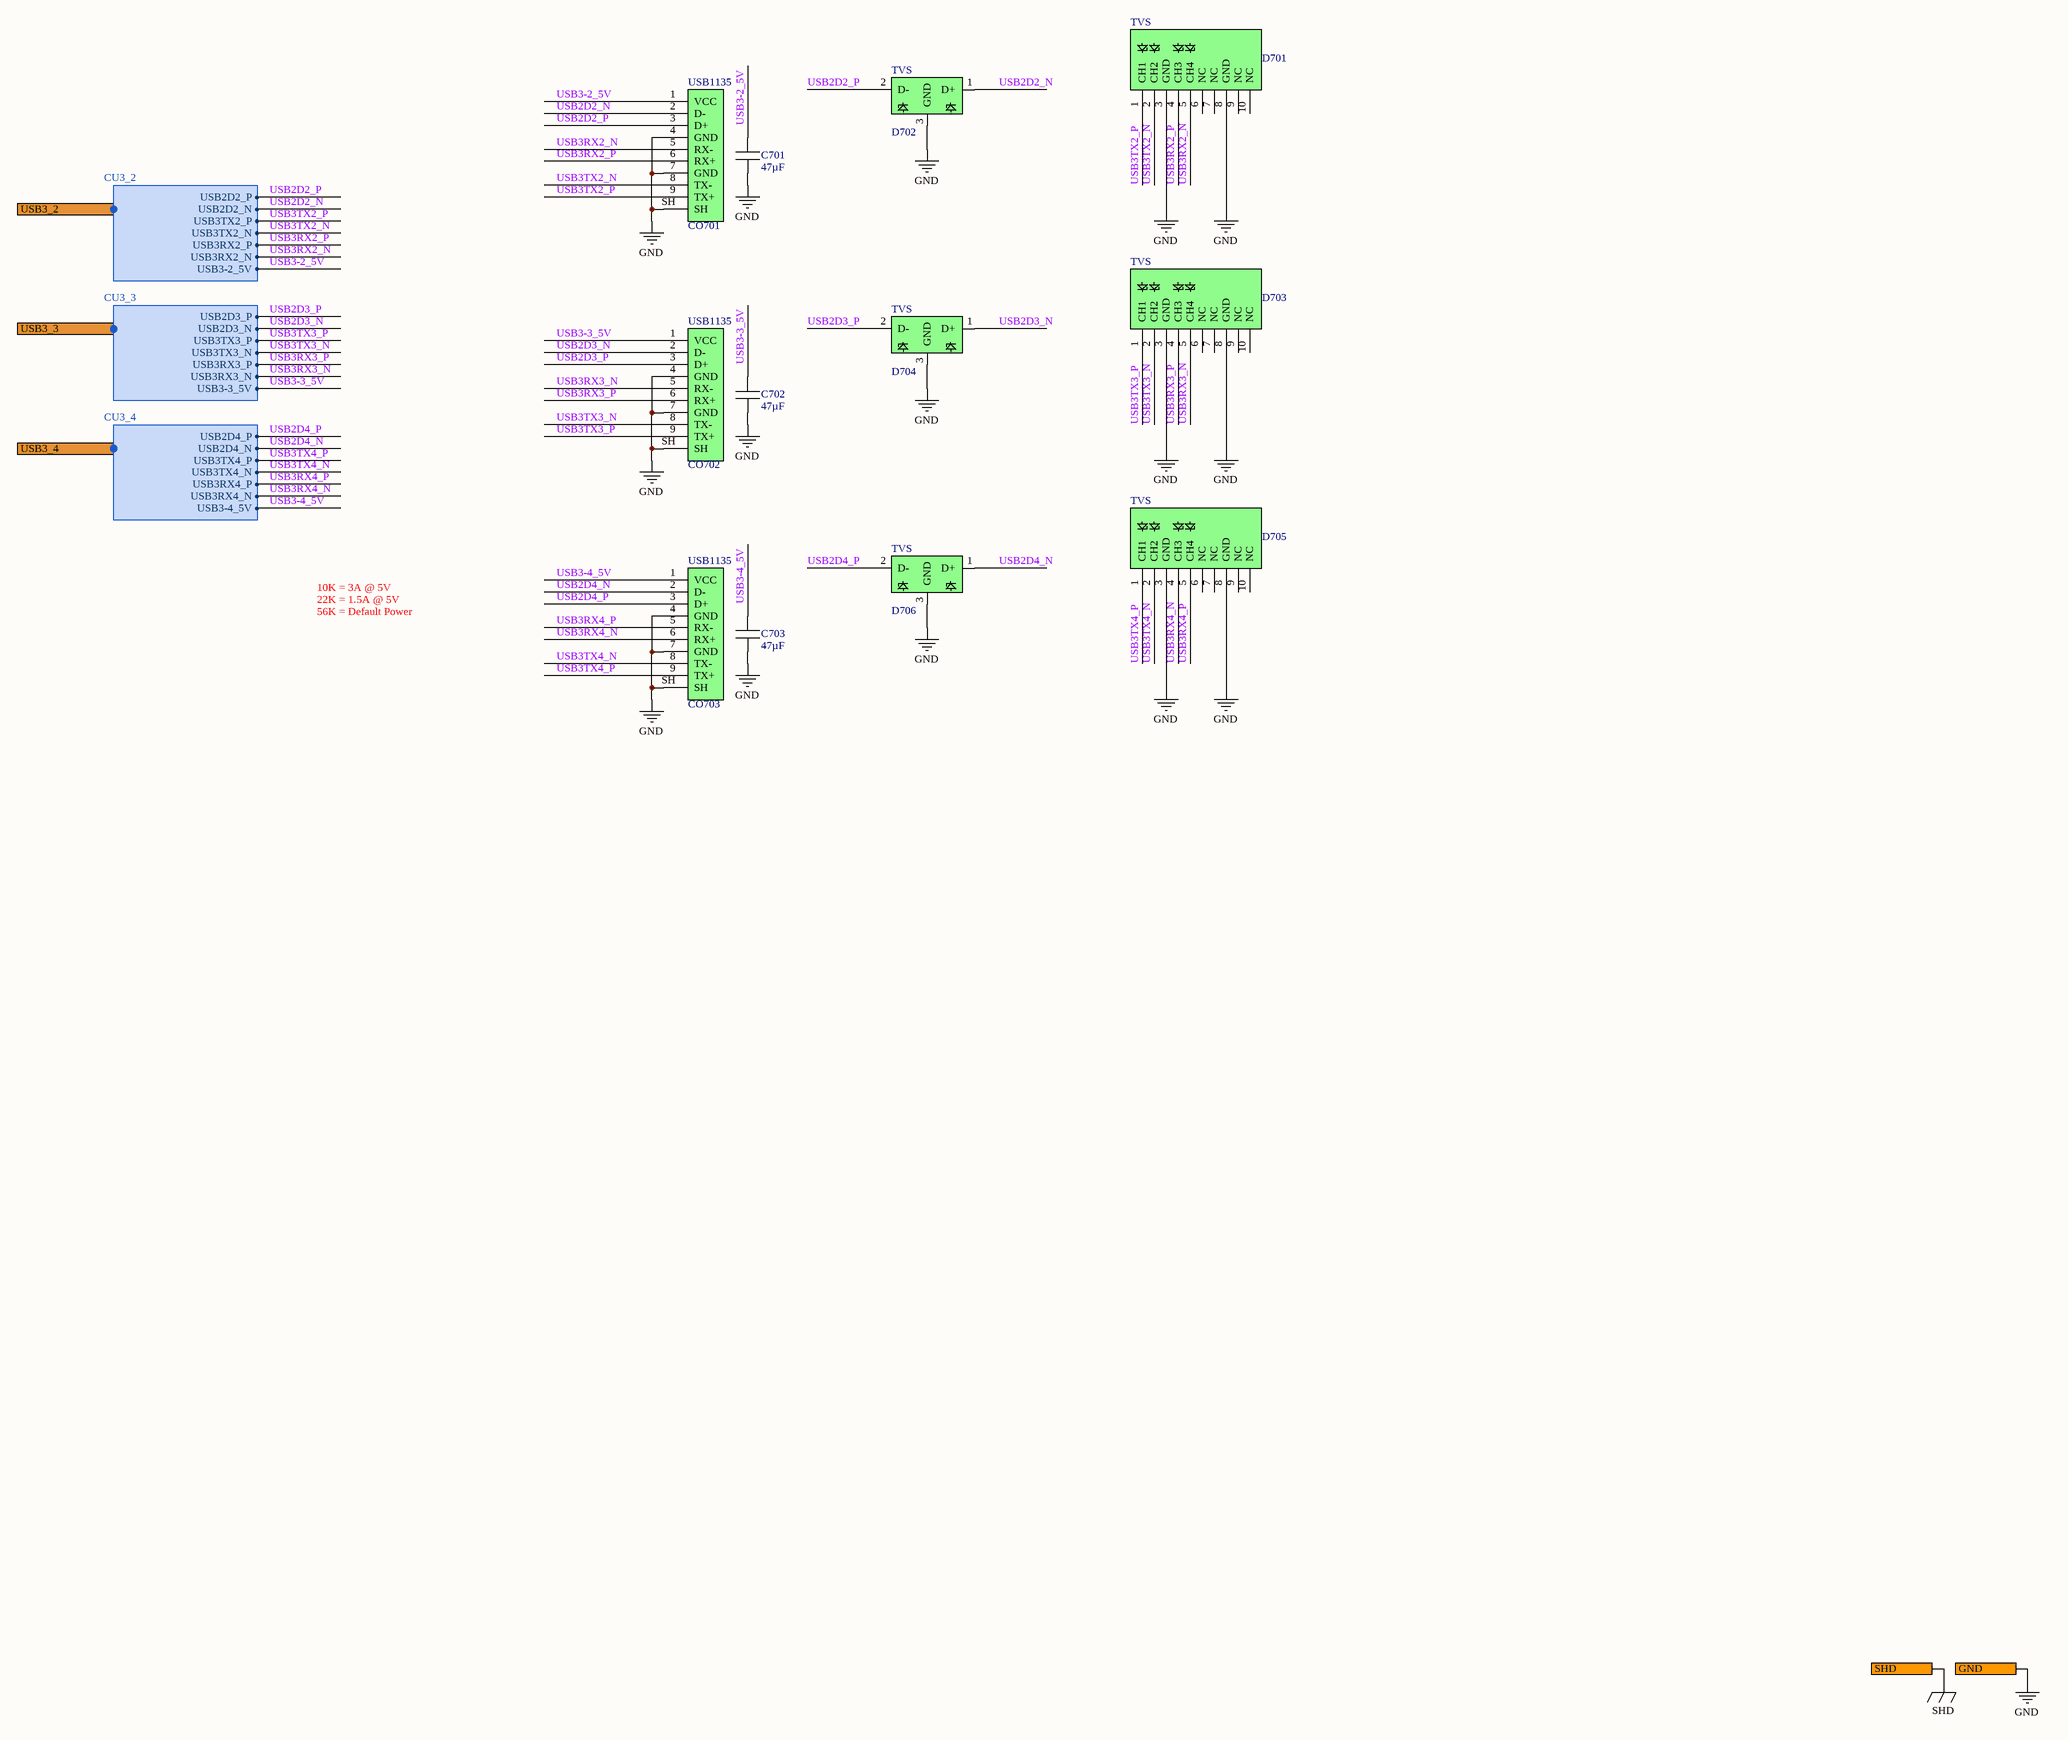
[diagram p12: 701_PCIe-USBports.SchDoc]

### Parts
C701  47µF  [C1210]
C702  47µF  [C1210]
C703  47µF  [C1210]
CO701  USB1135  [USB1135-15-9-L-B]
CO702  USB1135  [USB1135-15-9-L-B]
CO703  USB1135  [USB1135-15-9-L-B]
D701  TVS  [SOT-1176-1]
D702  TVS  [SOT-3]
D703  TVS  [SOT-1176-1]
D704  TVS  [SOT-3]
D705  TVS  [SOT-1176-1]
D706  TVS  [SOT-3]

### Ports
GND, SHD, USB3_2 (harness CU3_2), USB3_3 (harness CU3_3), USB3_4 (harness CU3_4)

### Harnesses
CU3_2: USB2D2_N, USB2D2_P, USB3TX2_N, USB3TX2_P, USB3RX2_N, USB3RX2_P, USB3-2_5V
CU3_3: USB2D3_N, USB2D3_P, USB3TX3_N, USB3TX3_P, USB3RX3_N, USB3RX3_P, USB3-3_5V
CU3_4: USB2D4_N, USB2D4_P, USB3TX4_N, USB3TX4_P, USB3RX4_N, USB3RX4_P, USB3-4_5V

### Nets
GND: C701.2 C702.2 C703.2 CO701.4(GND) CO701.7(GND) CO701.SH CO702.4(GND) CO702.7(GND) CO702.SH CO703.4(GND) CO703.7(GND) CO703.SH D701.3(GND) D701.8(GND) D702.3(GND) D703.3(GND) D703.8(GND) D704.3(GND) D705.3(GND) D705.8(GND) D706.3(GND) ; port GND, port SHD  [also labelled SHD]
USB2D2_N: CO701.2(D-) D702.1(D+) ; port USB3_2.USB2D2_N
USB2D2_P: CO701.3(D+) D702.2(D-) ; port USB3_2.USB2D2_P
USB2D3_N: CO702.2(D-) D704.1(D+) ; port USB3_3.USB2D3_N
USB2D3_P: CO702.3(D+) D704.2(D-) ; port USB3_3.USB2D3_P
USB2D4_N: CO703.2(D-) D706.1(D+) ; port USB3_4.USB2D4_N
USB2D4_P: CO703.3(D+) D706.2(D-) ; port USB3_4.USB2D4_P
USB3-2_5V: C701.1 CO701.1(VCC) ; port USB3_2.USB3-2_5V
USB3-3_5V: C702.1 CO702.1(VCC) ; port USB3_3.USB3-3_5V
USB3-4_5V: C703.1 CO703.1(VCC) ; port USB3_4.USB3-4_5V
USB3RX2_N: CO701.5(RX-) D701.5(CH4) ; port USB3_2.USB3RX2_N
USB3RX2_P: CO701.6(RX+) D701.4(CH3) ; port USB3_2.USB3RX2_P
USB3RX3_N: CO702.5(RX-) D703.5(CH4) ; port USB3_3.USB3RX3_N
USB3RX3_P: CO702.6(RX+) D703.4(CH3) ; port USB3_3.USB3RX3_P
USB3RX4_N: CO703.6(RX+) D705.4(CH3) ; port USB3_4.USB3RX4_N
USB3RX4_P: CO703.5(RX-) D705.5(CH4) ; port USB3_4.USB3RX4_P
USB3TX2_N: CO701.8(TX-) D701.2(CH2) ; port USB3_2.USB3TX2_N
USB3TX2_P: CO701.9(TX+) D701.1(CH1) ; port USB3_2.USB3TX2_P
USB3TX3_N: CO702.8(TX-) D703.2(CH2) ; port USB3_3.USB3TX3_N
USB3TX3_P: CO702.9(TX+) D703.1(CH1) ; port USB3_3.USB3TX3_P
USB3TX4_N: CO703.8(TX-) D705.2(CH2) ; port USB3_4.USB3TX4_N
USB3TX4_P: CO703.9(TX+) D705.1(CH1) ; port USB3_4.USB3TX4_P

Not connected (* = marked no-connect by the designer): D701 6(NC) 7(NC) 9(NC) 10(NC); D703 6(NC) 7(NC) 9(NC) 10(NC); D705 6(NC) 7(NC) 9(NC) 10(NC)

### Notes on the sheet
- 10K = 3A @ 5V
  22K = 1.5A @ 5V
  56K = Default Power
- Title
- Size:
- Date:
- File:
- A2
- Number:
- Time:
- Revision:
- Sheet
- of

### Library data of the parts
C701-C703 = CA0007: as C219 on sheet 201_USB3Hub; RefVal: 47µF
CO701-CO703 = CO0041: USB3.0 Type A receptacle Horizontal; Part Number: CO0041; ID: 41; RefVal: USB1135; ManfactPart: USB1135-15-9-L-B
D701 D703 D705 = DI0007: USB 3 TVS Diode; Part Number: DI0007; ManfactPart: PUSB3FA2Z; ID: 7; RefVal: TVS
D702 D704 D706 = DI0002: USB 2 TVS Diode; Part Number: DI0002; ManfactPart: TPD2EUSB30DRTR; ID: 2; RefVal: TVS

## Nets that join several sheets
+1V1: 101_Power (C140.1 IC105.3 L105.2 TP_+1V1.1), 201_USB3Hub (28 pins)
+1V05: 101_Power (C134.1 IC103.3 L103.2 TP_+1V05.1), 601_PCIe-USB (18 pins)
+3V3: 101_Power (9 pins), 201_USB3Hub (35 pins), 601_PCIe-USB (24 pins)
+5VR: 101_Power (17 pins), 401_RPi0 (8 pins), 501_RPiCM4 (17 pins), 201_USB3Hub (6 pins), 601_PCIe-USB (8 pins)
+5VU: 101_Power (9 pins), 201_USB3Hub (16 pins), 601_PCIe-USB (16 pins)
GND: 001_OverViewDevKIT (H1.1 H2.1 H3.1 H4.1), 101_Power (80 pins), 301_FrameUSB (33 pins), 401_RPi0 (22 pins), 501_RPiCM4 (100 pins), 201_USB3Hub (84 pins), 601_PCIe-USB (46 pins), 701_PCIe-USBports (21 pins)
ACTIVE_USB: 401_RPi0 (J402.2), 201_USB3Hub (R217.2)
ALERT: 101_Power (J103.4), 401_RPi0 (MO401.31 R404.2)
CPWR_ATTACH: 101_Power (R125.2), 401_RPi0 (MO401.29)
I2C0_SCL_Zero: 101_Power (IC106.7 J103.2), 401_RPi0 (MO401.5 R403.2), 501_RPiCM4 (R507.1), 201_USB3Hub (IC203.75 R240.1 R246.1), 601_PCIe-USB (R620.1 R622.1)
I2C0_SDA_Zero: 101_Power (IC106.8 J103.1), 401_RPi0 (MO401.3 R402.2), 501_RPiCM4 (R503.1), 201_USB3Hub (IC203.66 R238.1 R245.1), 601_PCIe-USB (R617.1 R618.1)
PCIe_CLK_N: 501_RPiCM4 (MO502.112), 601_PCIe-USB (R604.1)
PCIe_CLK_nREQ: 501_RPiCM4 (MO502.102), 601_PCIe-USB (IC602.30)
PCIe_CLK_P: 501_RPiCM4 (MO502.110), 601_PCIe-USB (R603.1)
PCIe_nRST: 501_RPiCM4 (MO502.109), 601_PCIe-USB (IC602.19)
PCIe_RX_N: 501_RPiCM4 (MO502.118), 601_PCIe-USB (C622.1)
PCIe_RX_P: 501_RPiCM4 (MO502.116), 601_PCIe-USB (C620.1)
PCIe_TX_N: 501_RPiCM4 (MO502.124), 601_PCIe-USB (IC602.28)
PCIe_TX_P: 501_RPiCM4 (MO502.122), 601_PCIe-USB (IC602.27)
PONRST: 501_RPiCM4 (MO501.100), 601_PCIe-USB (R608.2)
RESET_PWR: 101_Power (IC106.6 J103.5), 401_RPi0 (R405.1 R406.2)
USB2D1_N: 201_USB3Hub (IC203.90), 601_PCIe-USB (IC602.59)
USB2D1_P: 201_USB3Hub (IC203.89), 601_PCIe-USB (IC602.58)
USB2D2_N: 601_PCIe-USB (IC602.68), 701_PCIe-USBports (CO701.2 D702.1)
USB2D2_P: 601_PCIe-USB (IC602.67), 701_PCIe-USBports (CO701.3 D702.2)
USB2D3_N: 601_PCIe-USB (IC602.8), 701_PCIe-USBports (CO702.2 D704.1)
USB2D3_P: 601_PCIe-USB (IC602.7), 701_PCIe-USBports (CO702.3 D704.2)
USB2D4_N: 601_PCIe-USB (IC602.17), 701_PCIe-USBports (CO703.2 D706.1)
USB2D4_P: 601_PCIe-USB (IC602.16), 701_PCIe-USBports (CO703.3 D706.2)
USB3-2_5V: 601_PCIe-USB (IC603.4 IC603.5), 701_PCIe-USBports (C701.1 CO701.1)
USB3-3_5V: 601_PCIe-USB (IC603.11 IC603.12), 701_PCIe-USBports (C702.1 CO702.1)
USB3-4_5V: 601_PCIe-USB (IC604.4 IC604.5), 701_PCIe-USBports (C703.1 CO703.1)
USB3RX1_N: 201_USB3Hub (C244.2), 601_PCIe-USB (IC602.55)
USB3RX1_P: 201_USB3Hub (C243.2), 601_PCIe-USB (IC602.56)
USB3RX2_N: 601_PCIe-USB (IC602.65), 701_PCIe-USBports (CO701.5 D701.5)
USB3RX2_P: 601_PCIe-USB (IC602.64), 701_PCIe-USBports (CO701.6 D701.4)
USB3RX3_N: 601_PCIe-USB (IC602.5), 701_PCIe-USBports (CO702.5 D703.5)
USB3RX3_P: 601_PCIe-USB (IC602.4), 701_PCIe-USBports (CO702.6 D703.4)
USB3RX4_N: 601_PCIe-USB (IC602.13), 701_PCIe-USBports (CO703.6 D705.4)
USB3RX4_P: 601_PCIe-USB (IC602.14), 701_PCIe-USBports (CO703.5 D705.5)
USB3TX1_N: 201_USB3Hub (IC203.94), 601_PCIe-USB (C623.2)
USB3TX1_P: 201_USB3Hub (IC203.95), 601_PCIe-USB (C621.2)
USB3TX2_N: 601_PCIe-USB (C625.2), 701_PCIe-USBports (CO701.8 D701.2)
USB3TX2_P: 601_PCIe-USB (C624.2), 701_PCIe-USBports (CO701.9 D701.1)
USB3TX3_N: 601_PCIe-USB (C627.2), 701_PCIe-USBports (CO702.8 D703.2)
USB3TX3_P: 601_PCIe-USB (C626.2), 701_PCIe-USBports (CO702.9 D703.1)
USB3TX4_N: 601_PCIe-USB (C630.2), 701_PCIe-USBports (CO703.8 D705.2)
USB3TX4_P: 601_PCIe-USB (C628.2), 701_PCIe-USBports (CO703.9 D705.1)
USB_RESET: 401_RPi0 (MO401.16), 201_USB3Hub (R236.2)
USBF1_5V: 301_FrameUSB (5 pins), 201_USB3Hub (IC201.4 IC201.5 R201.1)
USBF1_CC1: 301_FrameUSB (CO301.5), 201_USB3Hub (IC203.12)
USBF1_CC2: 301_FrameUSB (CO301.25), 201_USB3Hub (IC203.13)
USBF1_N: 301_FrameUSB (CO301.7 CO301.27 D301.1), 201_USB3Hub (IC203.6)
USBF1_P: 301_FrameUSB (CO301.6 CO301.26 D301.2), 201_USB3Hub (IC203.5)
USBF1_RX1_N: 301_FrameUSB (CO301.30 D305.5), 201_USB3Hub (IC203.11)
USBF1_RX1_P: 301_FrameUSB (CO301.31 D305.4), 201_USB3Hub (IC203.10)
USBF1_RX2_N: 301_FrameUSB (CO301.10 D306.4), 201_USB3Hub (IC203.19)
USBF1_RX2_P: 301_FrameUSB (CO301.11 D306.5), 201_USB3Hub (IC203.20)
USBF1_TX1_N: 301_FrameUSB (CO301.3 D305.2), 201_USB3Hub (C248.2)
USBF1_TX1_P: 301_FrameUSB (CO301.2 D305.1), 201_USB3Hub (C245.2)
USBF1_TX2_N: 301_FrameUSB (CO301.23 D306.1), 201_USB3Hub (C249.2)
USBF1_TX2_P: 301_FrameUSB (CO301.22 D306.2), 201_USB3Hub (C251.2)
USBF2_5V: 301_FrameUSB (5 pins), 201_USB3Hub (IC205.4 IC205.5 R237.1)
USBF2_CC1: 301_FrameUSB (CO302.5), 201_USB3Hub (IC203.27)
USBF2_CC2: 301_FrameUSB (CO302.25), 201_USB3Hub (IC203.28)
USBF2_N: 301_FrameUSB (CO302.7 CO302.27 D302.1), 201_USB3Hub (IC203.30)
USBF2_P: 301_FrameUSB (CO302.6 CO302.26 D302.2), 201_USB3Hub (IC203.29)
USBF2_RX1_N: 301_FrameUSB (CO302.30 D307.5), 201_USB3Hub (IC203.35)
USBF2_RX1_P: 301_FrameUSB (CO302.31 D307.4), 201_USB3Hub (IC203.34)
USBF2_RX2_N: 301_FrameUSB (CO302.10 D308.4), 201_USB3Hub (IC203.40)
USBF2_RX2_P: 301_FrameUSB (CO302.11 D308.5), 201_USB3Hub (IC203.41)
USBF2_TX1_N: 301_FrameUSB (CO302.3 D307.2), 201_USB3Hub (C256.2)
USBF2_TX1_P: 301_FrameUSB (CO302.2 D307.1), 201_USB3Hub (C252.2)
USBF2_TX2_N: 301_FrameUSB (CO302.23 D308.1), 201_USB3Hub (C257.2)
USBF2_TX2_P: 301_FrameUSB (CO302.22 D308.2), 201_USB3Hub (C258.2)
USBF3_5V: 301_FrameUSB (C301.1 CO303.1), 201_USB3Hub (IC201.11 IC201.12)
USBF3_N: 301_FrameUSB (CO303.2 D303.1), 201_USB3Hub (IC203.82)
USBF3_P: 301_FrameUSB (CO303.3 D303.2), 201_USB3Hub (IC203.81)
USBF3_RX_N: 301_FrameUSB (CO303.5 D309.5), 201_USB3Hub (IC203.87)
USBF3_RX_P: 301_FrameUSB (CO303.6 D309.4), 201_USB3Hub (IC203.86)
USBF3_TX_N: 301_FrameUSB (CO303.8 D309.2), 201_USB3Hub (C260.2)
USBF3_TX_P: 301_FrameUSB (CO303.9 D309.1), 201_USB3Hub (C259.2)
USBF4_5V: 301_FrameUSB (C302.1 CO304.1), 201_USB3Hub (IC205.11 IC205.12)
USBF4_N: 301_FrameUSB (CO304.2 D304.1), 201_USB3Hub (IC203.15)
USBF4_P: 301_FrameUSB (CO304.3 D304.2), 201_USB3Hub (IC203.14)

## Assembly variants
Production: not fitted C107 D101 F101 J101 J102 R105 R238 R240 R245 R246 R503 R507 R517 R518 R520 R617 R618 R620 R622 TR101